# EAGLE design iwing-mrf_shield9 - Plus front-end (EAGLE 6.5.0)
IWING-MRF Shield The Extension Board containing peripherals for IWING-MRF v1.4. Please put IWING-MRF on TOP of Shield.
AUTHOR: Pasakorn Tiwatthanont; REV: 1
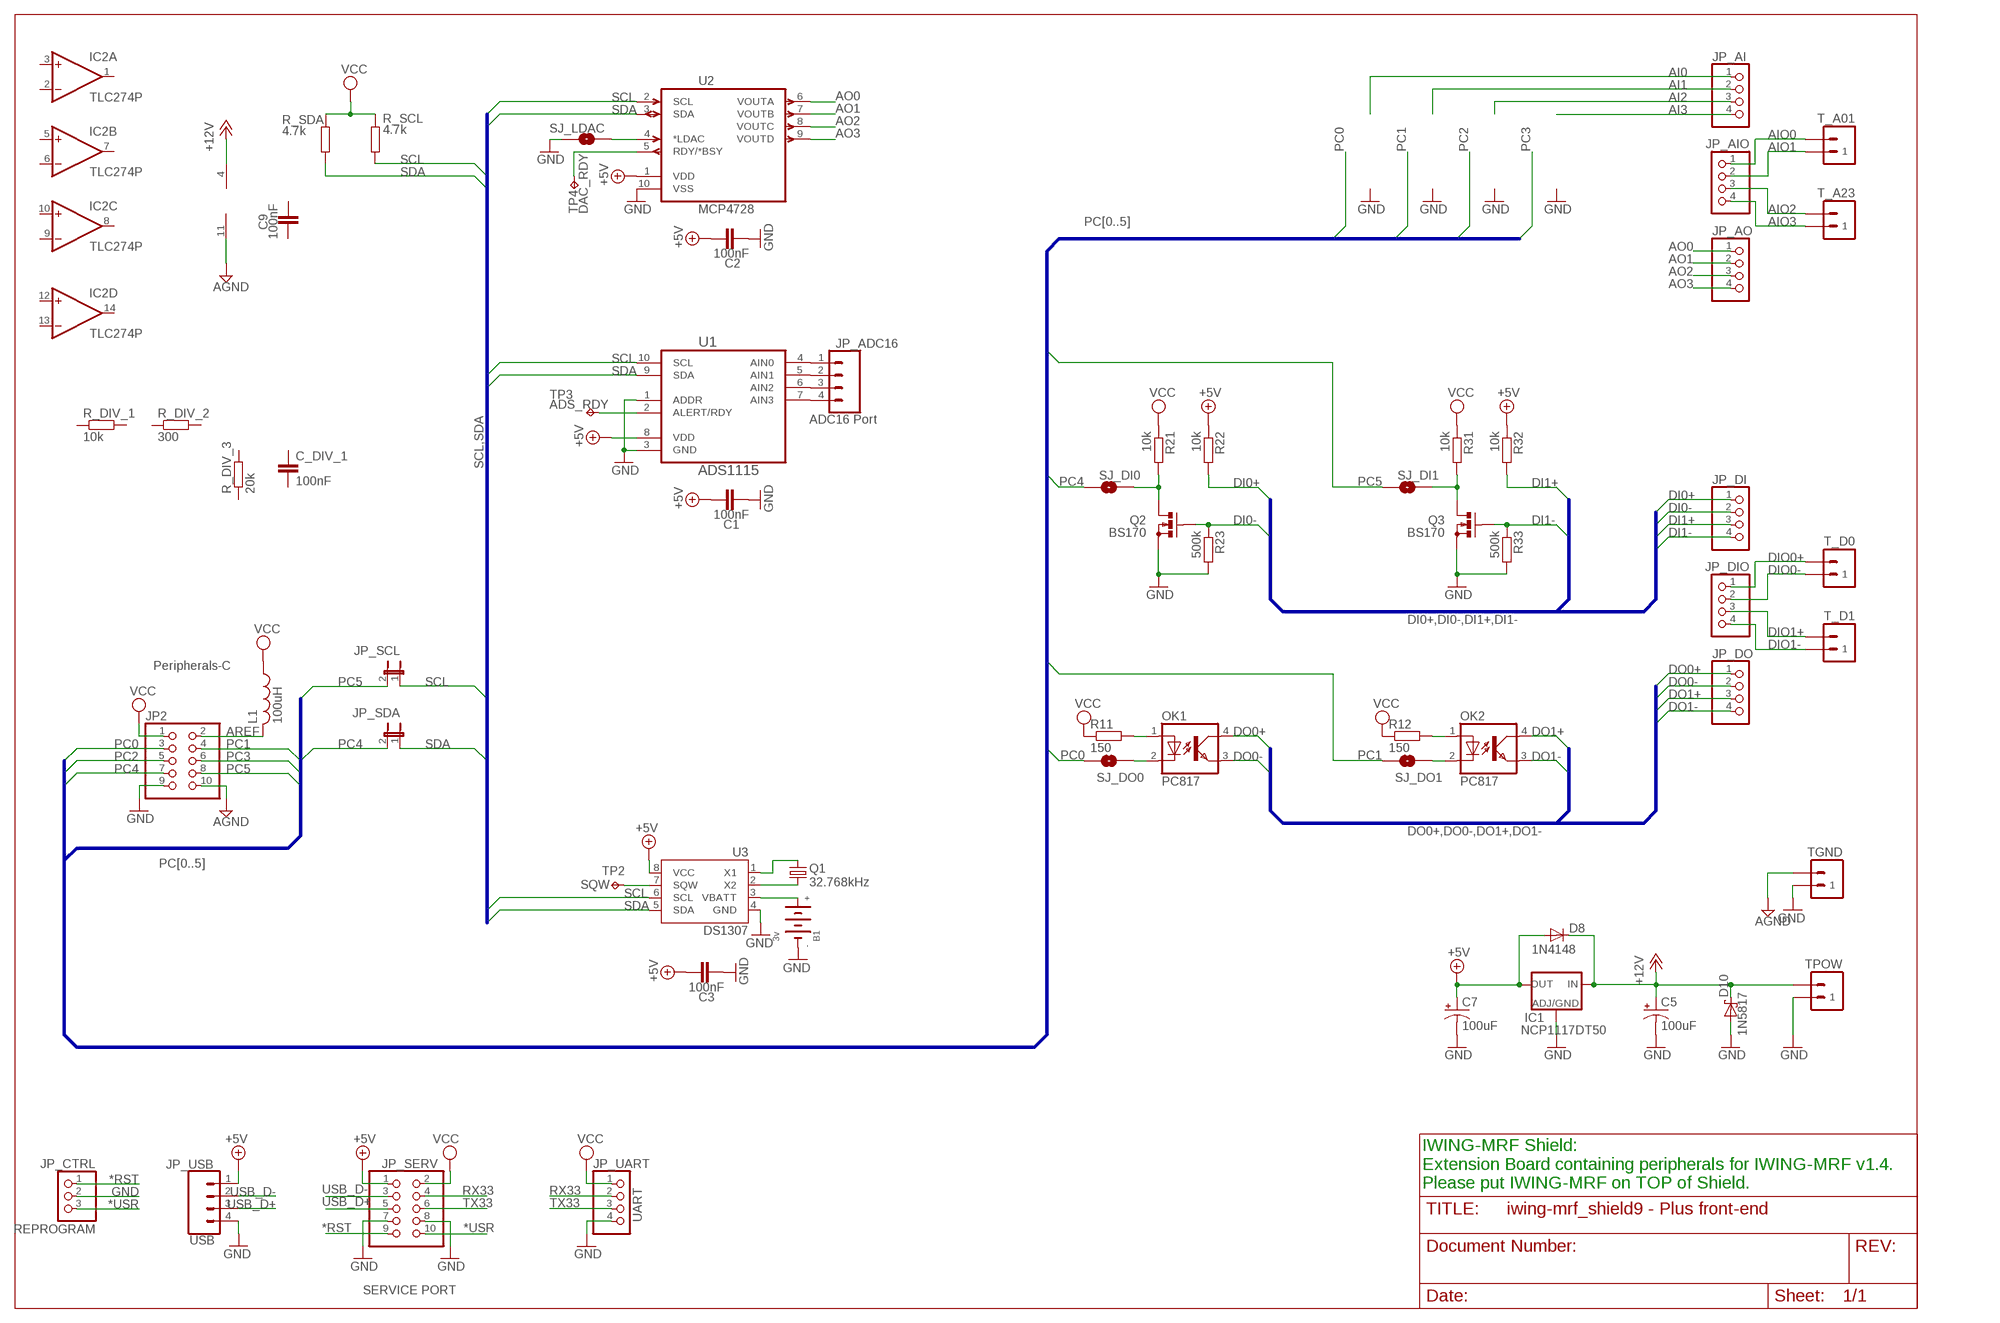
[diagram p0: schematic, sheet 1]

## Parts
B1  3v  BATTERYCR2032  [CR2032]
C1  100nF  RCL_C-EU050-025X075  [RCL_C050-025X075]
C2  100nF  RCL_C-EU050-025X075  [RCL_C050-025X075]
C3  100nF  RCL_C-EU050-025X075  [RCL_C050-025X075]
C5  100uF  RCL_CPOL-USE2.5-7  [RCL_E2,5-7]
C7  100uF  RCL_CPOL-USE2.5-7  [RCL_E2,5-7]
C9  100nF  RCL_C-EU050-025X075  [RCL_C050-025X075]
C_DIV_1  100nF  RCL_C-EU050-025X075  [RCL_C050-025X075]
D8  1N4148  1N4148-V  [DO35-100V]
D10  1N5817  1N5819-V  [DO41-150V]
IC1  NCP1117DT50  [DPACK]
IC2  TLC274P  [DIL14]
JP2  HEADER-2X5  [2X05]
JP_ADC16  ADC16 Port  M04PTH  [1X04]
JP_AI  HEADER-1X4ROUND  [1X04_ROUND]
JP_AIO  HEADER-1X4ROUND  [1X04_ROUND]
JP_AO  HEADER-1X4ROUND  [1X04_ROUND]
JP_CTRL  REPROGRAM  PINHD-1X3  [1X03]
JP_DI  HEADER-1X4ROUND  [1X04_ROUND]
JP_DIO  HEADER-1X4ROUND  [1X04_ROUND]
JP_DO  HEADER-1X4ROUND  [1X04_ROUND]
JP_SCL  JUMPER-2SMD-NO  [SJ_2S-NO]
JP_SDA  JUMPER-2SMD-NO  [SJ_2S-NO]
JP_SERV  SERVICE PORT  HEADER-2X5  [2X05]
JP_UART  HEADER-1X4ROUND  [1X04_ROUND]
JP_USB  USB  M04PTH  [1X04]
L1  100uH  L-US0204/5  [0204/5]
OK1  PC817  [DIL04]
OK2  PC817  [DIL04]
Q1  32.768kHz  CRYSTAL_CRYSTALTC26H  [CRYSTAL_TC26H]
Q2  BS170  [TO92-]
Q3  BS170  [TO92-]
R11  150  R-EU_0204/5  [0204/5]
R12  150  R-EU_0204/5  [0204/5]
R21  10k  R-EU_0204/5  [0204/5]
R22  10k  R-EU_0204/5  [0204/5]
R23  500k  R-EU_0204/5  [0204/5]
R31  10k  R-EU_0204/5  [0204/5]
R32  10k  R-EU_0204/5  [0204/5]
R33  500k  R-EU_0204/5  [0204/5]
R_DIV_1  10k  R-EU_0204/5  [0204/5]
R_DIV_2  300  R-EU_0204/5  [0204/5]
R_DIV_3  20k  R-EU_0204/5  [0204/5]
R_SCL  4.7k  R-EU_0204/5  [0204/5]
R_SDA  4.7k  R-EU_0204/5  [0204/5]
SJ_DI0  SOLDERJUMPERNO  [SJ_2S-NO]
SJ_DI1  SOLDERJUMPERNO  [SJ_2S-NO]
SJ_DO0  SOLDERJUMPERNO  [SJ_2S-NO]
SJ_DO1  SOLDERJUMPERNO  [SJ_2S-NO]
SJ_LDAC  SOLDERJUMPERNO  [SJ_2S-NO]
T_A01  ST02-5MM  [EK500V-02P]
T_A23  ST02-5MM  [EK500V-02P]
T_D0  ST02-5MM  [EK500V-02P]
T_D1  ST02-5MM  [EK500V-02P]
TGND  ST02-5MM  [EK500V-02P]
TP2  TPPAD1-13  [P1-13]
TP3  TPB1,27  [B1,27]
TP4  TPPAD1-13  [P1-13]
TPOW  ST02-5MM  [EK500V-02P]
U1  ADS1115  ADS1115IDGST  [MSOP-10]
U2  MCP4728  MCP4728-E/UN  [MSOP-10]
U3  DS1307  DS1307D08  [DIL08]

## Nets
*RST: JP_CTRL.1 JP_SERV.9
*USR: JP_CTRL.3 JP_SERV.10
+5V: C1.1 C2.1 C3.1 C7.+ D8.A IC1.4(OUT) JP_SERV.1 JP_USB.1 R22.1 R32.1 U1.8(VDD) U2.1(VDD) U3.8(VCC)
+12V: C5.+ D8.C D10.C IC1.3(IN) IC2.4(P:V+) TPOW.P$2
AGND: IC2.11(P:V-) JP2.10 TGND.P$2
AI0: JP_AI.1
AI1: JP_AI.2
AI2: JP_AI.3
AI3: JP_AI.4
AIO0: JP_AIO.1 T_A01.P$2
AIO1: JP_AIO.2 T_A01.P$1
AIO2: JP_AIO.3 T_A23.P$2
AIO3: JP_AIO.4 T_A23.P$1
AO0: JP_AO.1 U2.6(VOUTA)
AO1: JP_AO.2 U2.7(VOUTB)
AO2: JP_AO.3 U2.8(VOUTC)
AO3: JP_AO.4 U2.9(VOUTD)
AREF: JP2.2 L1.2
DI0+: JP_DI.1 R22.2
DI0-: JP_DI.2 Q2.2(G) R23.1
DI1+: JP_DI.3 R32.2
DI1-: JP_DI.4 Q3.2(G) R33.1
DIO0+: JP_DIO.1 T_D0.P$2
DIO0-: JP_DIO.2 T_D0.P$1
DIO1+: JP_DIO.3 T_D1.P$2
DIO1-: JP_DIO.4 T_D1.P$1
DO0+: JP_DO.1 OK1.4(COL)
DO0-: JP_DO.2 OK1.3(EMIT)
DO1+: JP_DO.3 OK2.4(COL)
DO1-: JP_DO.4 OK2.3(EMIT)
GND [power]: B1.- C1.2 C2.2 C3.2 C5.- C7.- D10.A IC1.1(ADJ) JP2.9 JP_CTRL.2 JP_SERV.7 JP_SERV.8 JP_UART.4 JP_USB.4 Q2.3(S) Q3.3(S) R23.2 R33.2 SJ_LDAC.1 TGND.P$1 TPOW.P$1 U1.1(ADDR) U1.3(GND) U2.10(VSS) U3.4(GND)
N$2: TP2.TP U3.7(SQW)
N$3: Q1.1 U3.2(X2)
N$4: TP4.TP U2.5(RDY/*BSY)
N$5: OK2.2(C) SJ_DO1.2
N$6: OK1.2(C) SJ_DO0.2
N$7: SJ_LDAC.2 U2.4(*LDAC)
N$8: TP3.TP U1.2(ALERT/RDY)
N$9: Q2.1(D) R21.2 SJ_DI0.1
N$10: Q3.1(D) R31.2 SJ_DI1.1
N$11: OK1.1(A) R11.2
N$13: JP_ADC16.1 U1.4(AIN0)
N$14: JP_ADC16.2 U1.5(AIN1)
N$15: JP_ADC16.3 U1.6(AIN2)
N$16: JP_ADC16.4 U1.7(AIN3)
N$20: OK2.1(A) R12.2
N$21: Q1.2 U3.1(X1)
N$23: B1.+ U3.3(VBATT)
PC0: JP2.3 SJ_DO0.1
PC1: JP2.4 SJ_DO1.1
PC2: JP2.5
PC3: JP2.6
PC4: JP2.7 JP_SDA.2 SJ_DI0.2
PC5: JP2.8 JP_SCL.2 SJ_DI1.2
RX33: JP_UART.2
SCL: JP_SCL.1 R_SCL.2 U1.10(SCL) U2.2(SCL) U3.6(SCL)
SDA: JP_SDA.1 R_SDA.2 U1.9(SDA) U2.3(SDA) U3.5(SDA)
TX33: JP_UART.3
USB_D+: JP_SERV.5 JP_USB.3
USB_D-: JP_SERV.3 JP_USB.2
VCC [power]: JP2.1 JP_SERV.2 JP_UART.1 L1.1 R11.1 R12.1 R21.1 R31.1 R_SCL.1 R_SDA.1
Unconnected: C9.1 C9.2 C_DIV_1.1 C_DIV_1.2 IC2.1(A:OUT) IC2.2(A:-IN) IC2.3(A:+IN) IC2.5(B:+IN) IC2.6(B:-IN) IC2.7(B:OUT) IC2.8(C:OUT) IC2.9(C:-IN) IC2.10(C:+IN) IC2.12(D:+IN) IC2.13(D:-IN) IC2.14(D:OUT) JP_SERV.4 JP_SERV.6 R_DIV_1.1 R_DIV_1.2 R_DIV_2.1 R_DIV_2.2 R_DIV_3.1 R_DIV_3.2

## Buses
SCL,SDA
DO0+,DO0-,DO1+,DO1-
DI0+,DI0-,DI1+,DI1-
PC[0..5]

## Notes on the sheet
- Peripherals-C
- UART
- IWING-MRF Shield:
  Extension Board containing peripherals for IWING-MRF v1.4.
  Please put IWING-MRF on TOP of Shield.

## Library data of the parts
B1 = microbuilder:BATTERY
C1-C3 C9 C_DIV_1 = ipas:RCL_C-EU: CAPACITOR, European symbol
C5 C7 = SDI12IB_v0.5:RCL_CPOL-US: POLARIZED CAPACITOR, American symbol
D8 = ipas:1N4148: DIODE high speed (Philips)
D10 = ipas:1N5819: DIODE 1N5817 THRU 1N5819 1.0 AMP. Schottky Barrier Rectifiers Features Low forward voltage drop High current capability High reliability High surge current capability
IC1 = ipas:NCP1117?*: Low drop-out positive fixed and adjustable voltage regulator
IC2 = linear:TLC274: OP AMP
JP2 JP_SERV = microbuilder:HEADER-2X5: PIN HEADER
JP_ADC16 JP_USB = ipas:M04: Header 4 Standard 4-pin 0.1" header. Use with straight break away headers (SKU : PRT-00116), right angle break away headers (PRT-00553), swiss pins (PRT-00743), machine pins (PRT-00117), and female headers (PRT-00115). Molex polarized connector foot print use with SKU : PRT-08231 with associated crimp pins and housings. 1MM SMD Version SKU: PRT-10208
JP_AI JP_AIO JP_AO JP_DI JP_DIO JP_DO JP_UART = microbuilder:HEADER-1X4: PIN HEADER
JP_CTRL = pinhead:PINHD-1X3: PIN HEADER
JP_SCL JP_SDA = SparkFun-Passives:JUMPER-2: Jumper Basic 0.1" spaced jumper. Use with breakaway headers.
L1 = ipas:L-US: INDUCTOR, American symbol
OK1 OK2 = ipas:PC817: SHARP OPTO COUPLER; MPN: PC817X4J000F; OC_FARNELL: 9707727; OC_NEWARK: 97K7059
Q1 = iwing-mrf:CRYSTAL_CRYSTAL: CRYSTAL
Q2 Q3 = ipas:BS170: N-CHANNEL MOS FET Small Signal MOSFET 500 mA, 60 Volts
R11 R12 R21-R23 R31-R33 R_DIV_1-R_DIV_3 R_SCL R_SDA = rcl:R-EU_: RESISTOR, European symbol
SJ_DI0 SJ_DI1 SJ_DO0 SJ_DO1 SJ_LDAC = SparkFun-Passives:SOLDERJUMPER: Solder Jumper Standard SMD solder jumper. Used to automate production. Two varients : Normally Open and Normally Closed are the same, but have different paste layers. NC will have a large amount of paste and should jumper during reflow.
T_A01 T_A23 T_D0 T_D1 TGND TPOW = ipas:ST02: Dinkle® Screw Terminal Block - 2 Way -5MM: EK500V series. Rated at 20A, 300VAC. Cable size: 2mm² Supplier: Altronics P2034A Source: http://www.dinkle.com/upfiles/proter21253708953.pdf -5.08MM: The back half of a EK500V4R-04P. Rated at 20A, 300VAC. Cable size: 2mm² Supplier: Altronics P2024 (half of) Source: http://www.dinkle.com/upfiles/proter21253708833.pdf -3.5MM: ED350V series. Rated at 10A, 300VAC. Cable size: 1.4mm² Supplier: Altronics P2028 Source: http://www.dinkle.com/upfiles/proter21253714491.pdf
TP2 = testpad:TP: Test pad; TP_SIGNAL_NAME: SQW
TP3 = testpad:TP: Test pad; TP_SIGNAL_NAME: ADS_RDY
TP4 = testpad:TP: Test pad; TP_SIGNAL_NAME: DAC_RDY
U1 = ipas:ADS1115IDGST: Analog-to-Digital Converter with Internal Reference
U2 = ipas:MCP4728-E/UN: IC, DAC, 12BIT, QUAD
U3 = ipas:DS1307: I2C real-time clock with battery backup.

## Net classes
0 default: width 0.254 mm
1 power: width 0.406 mm

## Board
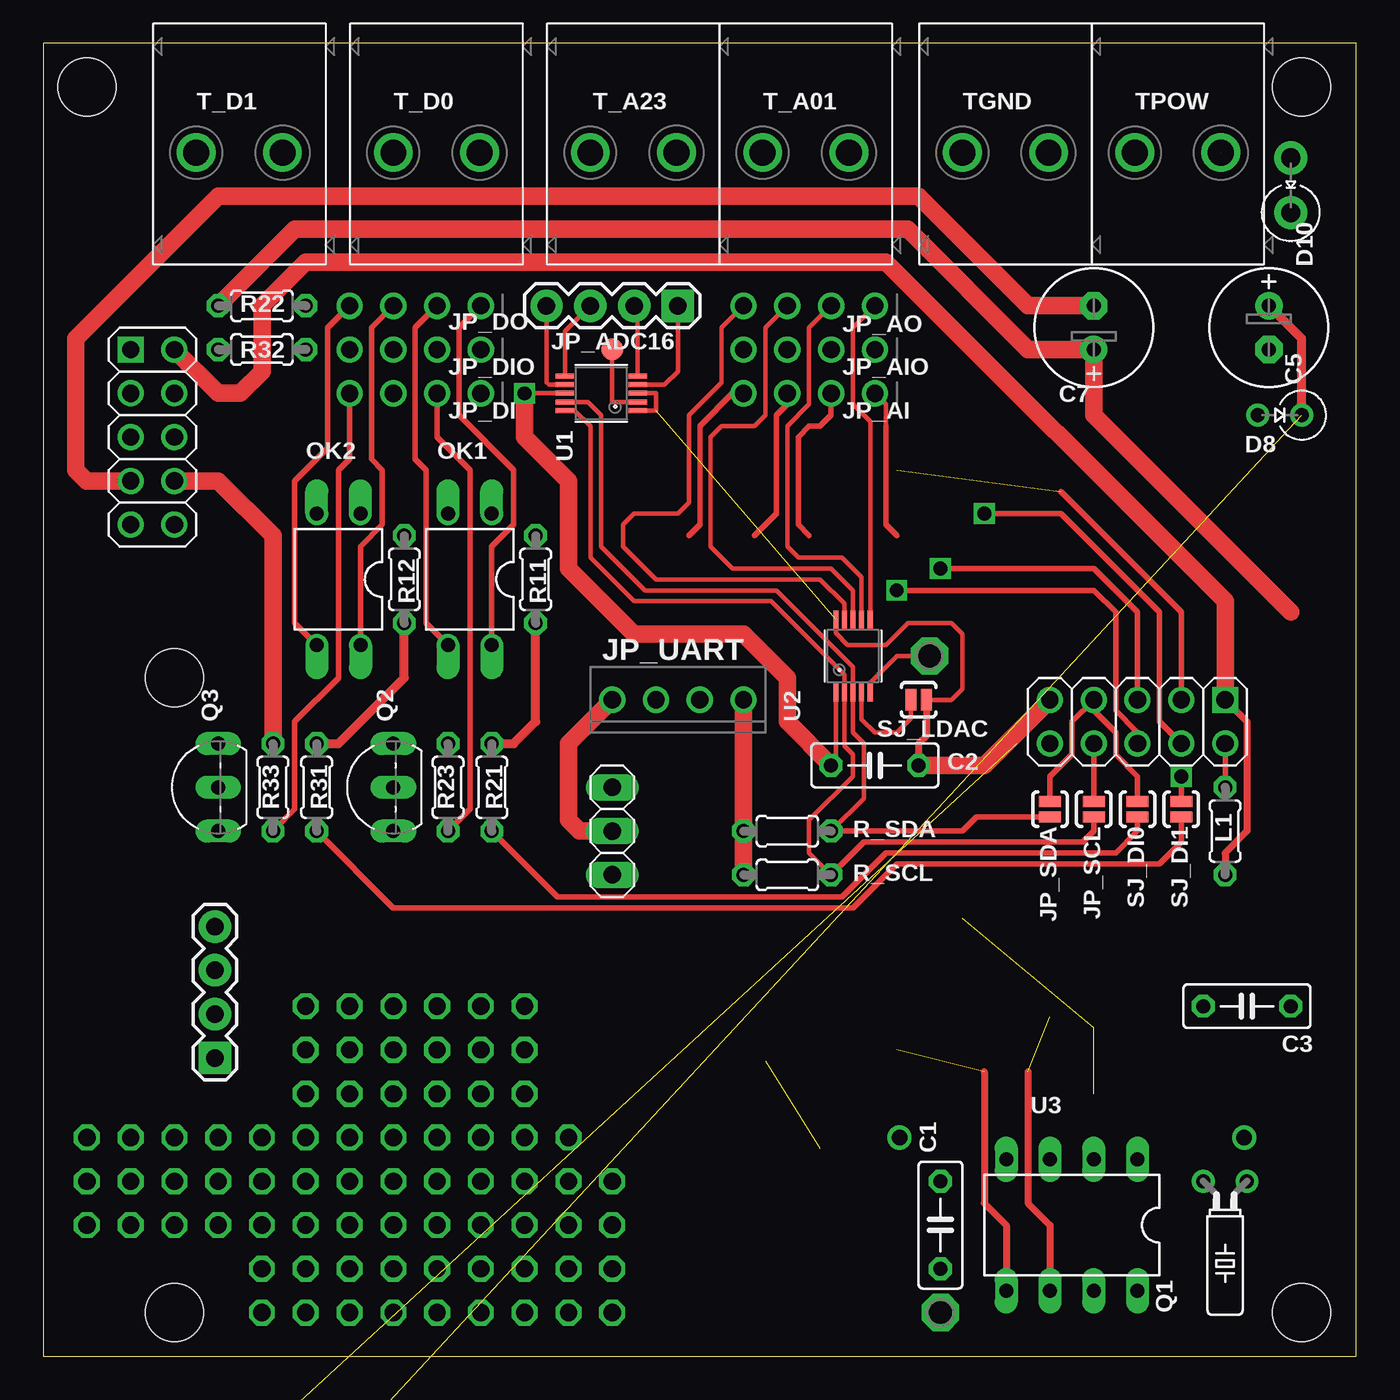
[diagram p1: board, top side]
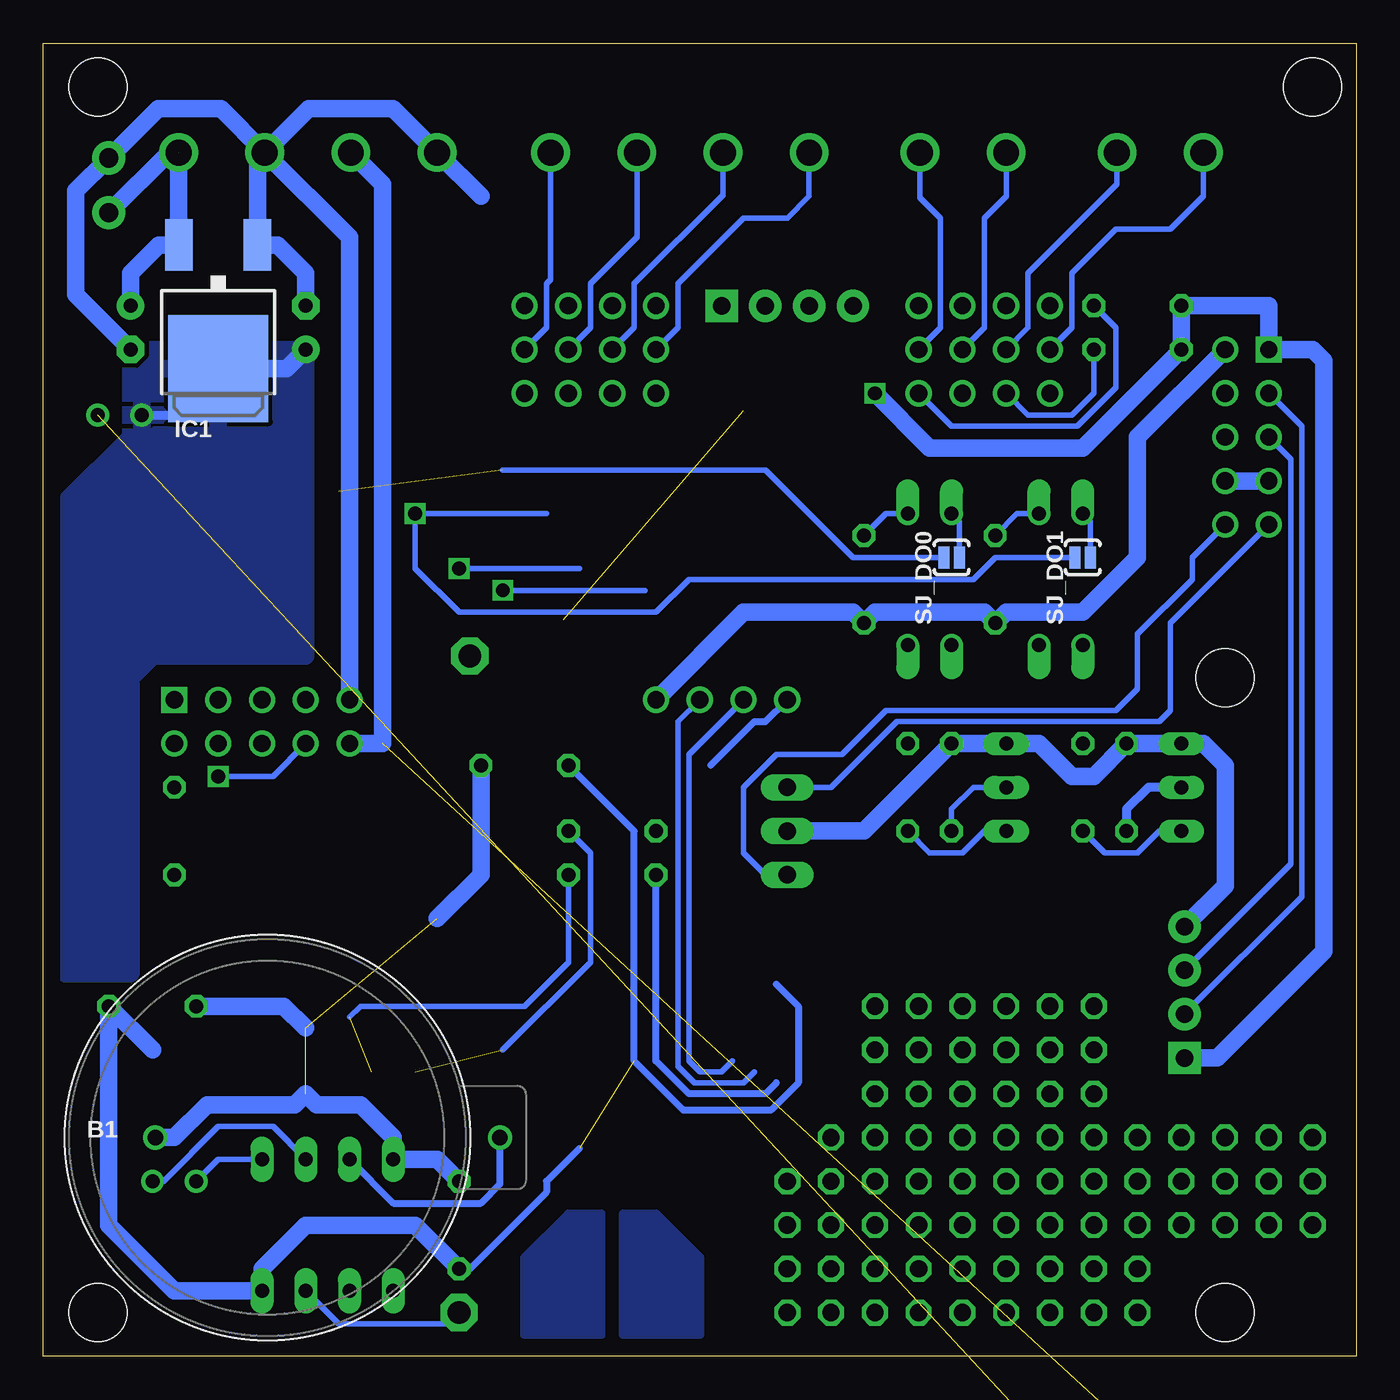
[diagram p2: board, bottom side, seen from below]

Size 76.2 x 76.2 mm. Coordinates in mm from the lower left corner, seen from the top.
Outline: 0,0 76.2,0 76.2,76.2 0,76.2 0,0
Copper layers (1*16): Top 0.035mm / dielectric 1.5mm / Bottom 0.035mm
Design rules "default *": minimum track width 10mil, minimum drill 24mil, track to track 10mil, track to pad 10mil, pad to pad 10mil, via to via 10mil, smd to smd 10mil, copper to edge 40mil, drill to drill 10mil, minimum pad ring 10mil, minimum via ring 8mil, stop-mask expansion 4mil, vias tented up to drill 0mil, thermal gap 10mil
Holes 3.35 mm at 7.62,39.37 7.62,2.54 2.54,73.66 73.03,73.66 73.03,2.54

### Footprints (pad centres in the part's own frame; a part is rotated, then mirrored left to right if it is on the bottom)
CR2032 = drill 0.9: + 10,0; - -10,0
RCL_C050-025X075 = drill 0.813 octagon: 1 -2.54,0; 2 2.54,0
RCL_E2,5-7 = drill 0.813 pad 1.6: + -1.27,0 | drill 0.813 pad 1.6 octagon: - 1.27,0
DO35-100V = drill 0.813: A 1.27,0; C -1.27,0
DO41-150V = drill 1.118 pad 1.93: A 1.587,0; C -1.587,0
DPACK = smd 1.6 x 3: 1 -2.28,-4.8; 3 2.28,-4.8 | smd 5.8 x 6.2: 4 0,2.38
DIL14 = drill 0.813 long: 1 -7.62,-3.81; 2 -5.08,-3.81; 3 -2.54,-3.81; 4 0,-3.81; 5 2.54,-3.81; 6 5.08,-3.81; 7 7.62,-3.81; 8 7.62,3.81; 9 5.08,3.81; 10 2.54,3.81; 11 0,3.81; 12 -2.54,3.81; 13 -5.08,3.81; 14 -7.62,3.81
2X05 = drill 1 square: 1 -5.08,-1.27 | drill 1: 2 -5.08,1.27; 3 -2.54,-1.27; 4 -2.54,1.27; 5 0,-1.27; 6 0,1.27; 7 2.54,-1.27; 8 2.54,1.27; 9 5.08,-1.27; 10 5.08,1.27
1X04 = drill 1.016 pad 1.88 square: 1 0,0 | drill 1.016 pad 1.88: 2 2.54,0; 3 5.08,0; 4 7.62,0
1X04_ROUND = drill 1 pad 1.524: 1 -3.81,0; 2 -1.27,0; 3 1.27,0; 4 3.81,0
1X03 = drill 1.016 long: 1 -2.54,0; 2 0,0; 3 2.54,0
SJ_2S-NO = smd 0.635 x 1.27: 1 -0.45,0; 2 0.45,0
0204/5 = drill 0.813 octagon: 1 -2.54,0; 2 2.54,0
DIL04 = drill 0.813 offset: 1 -1.27,-3.81; 2 1.27,-3.81; 3 1.27,3.81; 4 -1.27,3.81
CRYSTAL_TC26H = drill 0.813: 1 -1.27,0; 2 1.27,0
TO92- = drill 0.813 long: 1 -2.54,0; 2 0,0; 3 2.54,0
EK500V-02P = drill 1.5: P$1 0,0; P$2 5,0
P1-13 = drill 1.321 pad 2.159 octagon: TP 0,0
B1,27 = smd 1.27 x 1.27: TP 0,0
MSOP-10 = smd 0.292 x 1.067: 1 -1,-2.11; 2 -0.5,-2.11; 3 0,-2.11; 4 0.5,-2.11; 5 1,-2.11; 6 1,2.11; 7 0.5,2.11; 8 0,2.11; 9 -0.5,2.11; 10 -1,2.11
DIL08 = drill 0.813 long: 1 -3.81,-3.81; 2 -1.27,-3.81; 3 1.27,-3.81; 4 3.81,-3.81; 5 3.81,3.81; 6 1.27,3.81; 7 -1.27,3.81; 8 -3.81,3.81

### Placement (x,y rotation side)
B1  59.69,12.7 0 bottom
C1  52.07,7.62 90 top
C2  48.26,34.29 0 top
C3  69.85,20.32 180 top
C5  71.12,59.69 270 top
C7  60.96,59.69 90 top
C9  -5.08,-58.42 0 top  (outside the outline)
C_DIV_1  -5.08,-50.8 0 top  (outside the outline)
D8  71.75,54.61 180 top
D10  72.39,67.94 90 top
IC1  66.04,59.69 180 bottom
IC2  2.54,-17.78 0 top  (outside the outline)
JP2  63.5,36.83 180 top
JP_ADC16  36.83,60.96 180 top
JP_AI  44.45,55.88 180 top
JP_AIO  44.45,58.42 180 top
JP_AO  44.45,60.96 180 top
JP_CTRL  33.02,30.48 270 top
JP_DI  21.59,55.88 180 top
JP_DIO  21.59,58.42 180 top
JP_DO  21.59,60.96 180 top
JP_SCL  60.96,31.75 90 top
JP_SDA  58.42,31.75 90 top
JP_SERV  6.35,53.34 270 top
JP_UART  36.83,38.1 180 top
JP_USB  9.97,17.32 90 top
L1  68.58,30.48 90 top
OK1  24.77,45.09 180 top
OK2  17.14,45.09 180 top
Q1  68.58,10.16 180 top
Q2  20.32,33.02 90 top
Q3  10.16,33.02 90 top
R11  28.57,45.09 90 top
R12  20.95,45.09 90 top
R21  26.04,33.02 270 top
R22  12.7,60.96 0 top
R23  23.5,33.02 90 top
R31  15.88,33.02 270 top
R32  12.7,58.42 0 top
R33  13.34,33.02 90 top
R_DIV_1  -5.08,-27.94 0 top  (outside the outline)
R_DIV_2  -5.08,-35.56 0 top  (outside the outline)
R_DIV_3  -5.08,-43.18 0 top  (outside the outline)
R_SCL  43.18,27.94 0 top
R_SDA  43.18,30.48 0 top
SJ_DI0  63.5,31.75 90 top
SJ_DI1  66.04,31.75 90 top
SJ_DO0  23.5,46.35 0 bottom
SJ_DO1  15.88,46.35 0 bottom
SJ_LDAC  50.8,38.1 180 top
T_A01  41.75,69.85 0 top
T_A23  31.75,69.85 0 top
T_D0  20.32,69.85 0 top
T_D1  8.89,69.85 0 top
TGND  53.34,69.85 0 top
TP2  52.07,2.54 0 top
TP3  33.02,58.42 0 top
TP4  51.44,40.64 0 top
TPOW  63.34,69.85 0 top
U1  32.38,55.88 90 top
U2  46.99,40.64 0 top
U3  59.69,7.62 180 top

### Tracks (layer width: path | path; a pad name or v marks a point on that pad's centre or on a via)
*RST
  Bottom 0.305: JP_SERV.9 10.79,42.55 10.79,37.47 11.43,36.83 26.67,36.83 30.48,33.02 JP_CTRL.1
*USR
  Bottom 0.305: JP_CTRL.3 34.29,27.94 35.56,29.21 35.56,33.02 33.66,34.92 29.84,34.92 27.3,37.47 13.97,37.47 12.7,38.73 12.7,41.91 9.53,45.09 9.53,46.35 JP_SERV.10
+5V  (via drill 0.8)  (1 unrouted)
  Top 0.254: U2.1 45.99,34.56 C2.1 | U1.8 v27.94,55.88
  Top 1.016: R22.1 14.61,65.41 50.16,65.41 57.15,58.42 C7.+ 60.96,54.61 72.39,43.18 | v27.94,55.88 27.94,53.34 30.48,50.8 30.48,45.72 34.29,41.91 40.64,41.91 43.18,39.37 43.18,36.83 C2.1
  Bottom 0.406: 33.66,21.59 32.38,20.32 32.38,15.88 33.97,14.29 39.05,14.29 41.91,17.14 41.91,30.48 C2.1 | 45.09,12.06 46.99,10.16 46.99,9.53 51.44,5.08 C1.1
  Bottom 0.508: D8.A 68.74,54.61 IC1.4
  Bottom 1.016: C7.+ 62.07,57.31 IC1.4 | v27.94,55.88 24.77,52.7 15.88,52.7 R32.1 R22.1 5.08,60.96 JP_SERV.1 2.54,58.42 1.91,57.78 1.91,23.5 8.08,17.32 JP_USB.1 | 69.85,17.78 C3.1 72.39,7.62 68.58,3.81 U3.8 63.5,5.08 60.96,7.62 54.61,7.62 C1.1
  pour Bottom: 60.96,40.64 69.85,40.64 71.12,39.37 71.12,22.23 74.93,22.23 74.93,49.53 71.12,53.34 71.12,58.42 60.96,58.42
+12V  (2 unrouted)
  Top 0.508: D8.C 73.03,59.05 C5.+
  Bottom 1.016: 68.32,69.83 IC1.3 69.5,64.49 71.12,62.87 C5.+ | D10.C 68.9,69.85 TPOW.P$2
AC+
  pour Bottom (no thermals): 43.81,8.26 45.72,8.26 48.26,5.71 48.26,1.27 43.81,1.27
AC-
  pour Bottom (no thermals): 38.1,5.71 40.64,8.26 42.55,8.26 42.55,1.27 38.1,1.27
AGND  (1 unrouted)
  Bottom 1.016: JP2.10 56.52,35.56 56.52,68.03 TGND.P$2
AI0
  Top 0.254: 48.9,53.98 48.9,55.24 JP_AI.1
  Top 0.305: 49.53,47.62 48.9,48.26 48.9,53.98
AI1
  Top 0.305: 44.45,47.62 43.81,48.26 43.81,53.34 44.45,53.98 45.09,53.98 45.72,54.61 JP_AI.2
AI2
  Top 0.305: 41.27,47.62 42.55,48.9 42.55,54.61 43.18,55.24 JP_AI.3
AI3
  Top 0.305: 37.47,47.62 38.1,48.26 38.1,53.98 40.01,55.88 JP_AI.4
AIO0
  Bottom 0.305: JP_AIO.1 46.99,59.69 46.99,62.23 46.75,62.47 T_A01.P$2
AIO1
  Bottom 0.305: JP_AIO.2 44.45,59.69 44.45,62.23 41.75,64.93 T_A01.P$1
AIO2
  Bottom 0.305: JP_AIO.3 41.91,59.69 41.91,62.23 36.75,67.39 T_A23.P$2
AIO3
  Bottom 0.305: JP_AIO.4 39.37,59.69 39.37,62.23 35.56,66.04 33.02,66.04 31.75,67.31 T_A23.P$1
AO0
  Top 0.254: U2.6 47.99,54.24 46.99,55.24 46.99,59.69 JP_AO.1
AO1
  Top 0.254: U2.7 47.49,45.22 46.35,46.35 43.81,46.35 43.18,46.99 43.18,53.98 44.45,55.24 44.45,59.69 JP_AO.2
AO2
  Top 0.254: U2.8 46.99,44.45 45.72,45.72 40.01,45.72 38.73,46.99 38.73,53.34 39.37,53.98 41.27,53.98 41.91,54.61 41.91,59.69 JP_AO.3
AO3
  Top 0.254: U2.9 46.49,43.68 45.09,45.09 35.56,45.09 33.66,46.99 33.66,48.26 34.29,48.9 36.83,48.9 37.47,49.53 37.47,54.61 39.37,56.52 39.37,59.69 JP_AO.4
AREF
  Top 0.305: L1.2 JP2.2
DI0+
  Bottom 0.305: JP_DI.1 23.5,53.98 16.19,53.98 13.97,56.2 13.97,59.69 R22.2
DI0-
  Top 0.305: JP_DI.2 22.86,53.34 24.77,51.44 24.77,31.75 R23.1
  Bottom 0.305: Q2.2 22.23,33.02 23.5,31.75 R23.1
DI1+
  Bottom 0.305: JP_DI.3 19.05,54.61 16.51,54.61 15.24,55.88 R32.2
DI1-
  Top 0.305: JP_DI.4 17.78,52.07 17.14,51.44 17.14,39.37 14.61,36.83 14.61,31.75 R33.1
  Bottom 0.508: Q3.2 12.06,33.02 13.34,31.75 R33.1
DIO0+
  Bottom 0.305: JP_DIO.1 24.13,59.69 24.13,66.04 25.32,67.23 T_D0.P$2
DIO0-
  Bottom 0.305: JP_DIO.2 21.59,59.69 21.59,66.04 20.32,67.31 T_D0.P$1
DIO1+
  Bottom 0.305: JP_DIO.3 19.05,59.69 19.05,62.87 13.89,68.03 T_D1.P$2
DIO1-
  Bottom 0.305: JP_DIO.4 16.51,59.69 16.51,62.87 13.97,65.41 10.79,65.41 8.89,67.31 T_D1.P$1
DO0+
  Top 0.305: JP_DO.1 24.13,59.69 24.13,54.61 27.3,51.44 27.3,48.26 26.04,46.99 OK1.4
DO0-
  Top 0.305: JP_DO.2 21.59,59.69 21.59,52.07 22.23,51.44 22.23,42.55 OK1.3
DO1+
  Top 0.305: JP_DO.3 19.05,59.69 19.05,52.07 19.68,51.44 19.68,48.26 18.41,46.99 OK2.4
DO1-
  Top 0.305: JP_DO.4 16.51,59.69 16.51,52.7 14.61,50.8 14.61,42.55 OK2.3
GND  (3 unrouted)
  Top 0.254: U2.10 45.99,41.96 46.67,41.27 48.9,41.27 50.16,42.55 52.7,42.55 53.34,41.91 53.34,38.73 52.7,38.1 SJ_LDAC.1 | U1.3 35.56,55.88 35.56,54.88 U1.1
  Top 0.406: SJ_LDAC.1 51.25,36.01 50.8,35.56 C2.2
  Top 1.016: C2.2 54.61,34.29 JP2.9 | JP_CTRL.2 31.11,30.48 30.48,31.11 30.48,35.56 JP_UART.4 | JP_SERV.8 10.16,50.8 13.34,47.62 R33.2 | JP_SERV.7 2.54,50.8 1.91,51.44 1.91,59.05 10.16,67.31 50.8,67.31 57.15,60.96 C7.-
  Bottom 0.406: 37.47,34.29 34.92,36.83 34.29,36.83 JP_UART.4
  Bottom 1.016: TPOW.P$1 63.76,69.43 IC1.1 62.59,64.49 60.96,62.87 C7.- | TPOW.P$1 60.8,72.39 55.88,72.39 TGND.P$1 50.8,67.31 | TPOW.P$1 65.88,72.39 69.53,72.39 D10.A 74.3,67.63 74.3,61.59 C5.- | JP2.9 58.42,64.93 TPOW.P$1 | JP_CTRL.2 28.57,30.48 R23.2 Q2.3 18.41,35.56 16.51,33.66 15.24,33.66 R33.2 Q3.3 8.89,35.56 7.62,34.29 7.62,27.29 JP_USB.4 | JP_SERV.7 JP_SERV.8 | 53.34,25.4 50.8,27.94 C2.2 | 60.96,19.05 62.23,20.32 C3.2 | B1.- 68.58,12.7 66.67,14.61 61.59,14.61 60.96,15.24 60.33,14.61 57.78,14.61 55.88,12.7 U3.4 53.34,11.43 C1.2
N$2
  Bottom 0.305: U3.7 59.05,1.91 52.7,1.91 TP2.TP
N$3
  Bottom 0.305: Q1.1 69.22,10.16 66.04,13.34 62.87,13.34 U3.2
N$4
  Top 0.254: U2.5 47.99,39.1 49.53,40.64 TP4.TP
N$5
  Bottom 0.305: OK2.2 15.43,48.45 SJ_DO1.2
N$6
  Bottom 0.305: OK1.2 23.05,48.45 SJ_DO0.2
N$7
  Top 0.254: U2.4 47.49,36.97 48.26,36.2 49.53,36.2 50.35,37.02 SJ_LDAC.2
N$8
  Top 0.254: U1.2 33.02,55.38 TP3.TP
N$9
  Top 0.305: SJ_DI0.1 63.5,30.48 62.23,29.21 48.9,29.21 46.35,26.67 29.84,26.67 R21.2
  Bottom 0.305: R21.2 24.77,29.21 22.86,29.21 21.59,30.48 Q2.1
N$10
  Top 0.305: SJ_DI1.1 66.04,29.84 64.77,28.57 49.53,28.57 46.99,26.04 20.32,26.04 R31.2
  Bottom 0.305: R31.2 14.61,29.21 12.7,29.21 11.43,30.48 Q3.1
N$11
  Bottom 0.305: R11.2 27.3,48.9 OK1.1
N$12  (via drill 1)
  other vias: 5.08,12.7
N$13
  Top 0.254: U1.4 36.06,56.38 36.83,57.15 JP_ADC16.1
N$14
  Top 0.254: U1.5 34.49,60.76 JP_ADC16.2
N$15
  Top 0.254: U1.6 30.28,59.49 JP_ADC16.3
N$16
  Top 0.254: U1.7 29.34,56.38 29.21,56.52 JP_ADC16.4
N$17  (via drill 1)
  other vias: 5.08,10.16
N$18  (via drill 1)
  other vias: 5.08,7.62
N$19  (via drill 1)
  other vias: 7.62,7.62
N$20
  Bottom 0.305: R12.2 19.68,48.9 OK2.1
N$21
  Bottom 0.305: U3.1 66.04,11.43 Q1.2
N$22  (via drill 1)
  other vias: 7.62,10.16
N$23
  Bottom 0.406: U3.3 55.88,8.89 50.8,8.89 49.69,10 B1.+
N$24  (via drill 1)
  other vias: 7.62,12.7
N$25  (via drill 1)
  other vias: 10.16,12.7
N$27  (via drill 1)
  other vias: 10.16,10.16
N$28  (via drill 1)
  other vias: 10.16,7.62
N$29  (via drill 1)
  other vias: 12.7,7.62
N$30  (via drill 1)
  other vias: 12.7,5.08
N$31  (via drill 1)
  other vias: 12.7,2.54
N$32  (via drill 1)
  other vias: 15.24,2.54
N$33  (via drill 1)
  other vias: 15.24,5.08
N$34  (via drill 1)
  other vias: 15.24,7.62
N$35  (via drill 1)
  other vias: 12.7,10.16
N$36  (via drill 1)
  other vias: 12.7,12.7
N$37  (via drill 1)
  other vias: 15.24,12.7
N$38  (via drill 1)
  other vias: 15.24,10.16
N$39  (via drill 1)
  other vias: 17.78,12.7
N$40  (via drill 1)
  other vias: 17.78,10.16
N$41  (via drill 1)
  other vias: 17.78,7.62
N$42  (via drill 1)
  other vias: 17.78,5.08
N$43  (via drill 1)
  other vias: 17.78,2.54
N$44  (via drill 1)
  other vias: 20.32,12.7
N$45  (via drill 1)
  other vias: 20.32,10.16
N$46  (via drill 1)
  other vias: 20.32,7.62
N$47  (via drill 1)
  other vias: 20.32,5.08
N$48  (via drill 1)
  other vias: 20.32,2.54
N$49  (via drill 1)
  other vias: 22.86,12.7
N$50  (via drill 1)
  other vias: 22.86,10.16
N$51  (via drill 1)
  other vias: 22.86,7.62
N$52  (via drill 1)
  other vias: 22.86,5.08
N$53  (via drill 1)
  other vias: 22.86,2.54
N$54  (via drill 1)
  other vias: 25.4,2.54
N$55  (via drill 1)
  other vias: 25.4,5.08
N$56  (via drill 1)
  other vias: 25.4,7.62
N$57  (via drill 1)
  other vias: 25.4,10.16
N$58  (via drill 1)
  other vias: 25.4,12.7
N$59  (via drill 1)
  other vias: 27.94,12.7
N$60  (via drill 1)
  other vias: 27.94,10.16
N$61  (via drill 1)
  other vias: 27.94,7.62
N$62  (via drill 1)
  other vias: 27.94,5.08
N$63  (via drill 1)
  other vias: 27.94,2.54
N$64  (via drill 1)
  other vias: 30.48,2.54
N$65  (via drill 1)
  other vias: 30.48,5.08
N$66  (via drill 1)
  other vias: 30.48,7.62
N$67  (via drill 1)
  other vias: 30.48,10.16
N$68  (via drill 1)
  other vias: 30.48,12.7
N$69  (via drill 1)
  other vias: 33.02,10.16
N$70  (via drill 1)
  other vias: 33.02,7.62
N$71  (via drill 1)
  other vias: 33.02,5.08
N$72  (via drill 1)
  other vias: 33.02,2.54
N$73  (via drill 1)
  other vias: 27.94,15.24
N$74  (via drill 1)
  other vias: 25.4,15.24
N$75  (via drill 1)
  other vias: 22.86,15.24
N$76  (via drill 1)
  other vias: 20.32,15.24
N$77  (via drill 1)
  other vias: 17.78,15.24
N$78  (via drill 1)
  other vias: 15.24,15.24
N$79  (via drill 1)
  other vias: 2.54,12.7
N$80  (via drill 1)
  other vias: 2.54,10.16
N$81  (via drill 1)
  other vias: 2.54,7.62
N$82  (via drill 1)
  other vias: 15.24,17.78
N$83  (via drill 1)
  other vias: 17.78,17.78
N$84  (via drill 1)
  other vias: 20.32,17.78
N$85  (via drill 1)
  other vias: 22.86,17.78
N$86  (via drill 1)
  other vias: 25.4,17.78
N$87  (via drill 1)
  other vias: 27.94,17.78
N$88  (via drill 1)
  other vias: 27.94,20.32
N$89  (via drill 1)
  other vias: 25.4,20.32
N$90  (via drill 1)
  other vias: 22.86,20.32
N$91  (via drill 1)
  other vias: 20.32,20.32
N$92  (via drill 1)
  other vias: 17.78,20.32
N$93  (via drill 1)
  other vias: 15.24,20.32
PC0  (1 unrouted)
  Top 0.305: 59.05,50.16 66.04,43.18 JP2.3
  Bottom 0.305: SJ_DO0.1 29.21,46.35 34.29,51.44 49.53,51.44
PC1  (via drill 0.8)
  Top 0.305: JP2.4 64.77,36.83 64.77,43.18 59.05,48.9 v54.61,48.9
  Bottom 0.305: 46.99,48.9 v54.61,48.9 54.61,45.72 52.07,43.18 40.64,43.18 38.73,45.09 22.23,45.09 20.95,46.35 SJ_DO1.1
PC2  (via drill 0.8)
  Top 0.305: JP2.5 63.5,43.18 60.96,45.72 v52.07,45.72
  Bottom 0.305: v52.07,45.72 45.09,45.72
PC3  (via drill 0.8)
  Top 0.305: v49.53,44.45 60.96,44.45 62.23,43.18 62.23,37.47 63.5,36.2 JP2.6
  Bottom 0.305: v49.53,44.45 41.27,44.45
PC4
  Top 0.305: JP_SDA.2 58.42,33.66 59.69,34.92 59.69,36.83 JP2.7 60.96,37.47 62.23,36.2 62.23,34.92 63.5,33.66 SJ_DI0.2
PC5  (via drill 0.8)
  Top 0.305: JP_SCL.2 JP2.8 | SJ_DI1.2 v66.04,33.66
  Bottom 0.305: v66.04,33.66 62.87,33.66 JP2.8
RX33
  Bottom 0.305: JP_UART.2 39.37,36.83 39.37,16.83 38.42,15.88 35.56,15.88 34.92,16.51
SCL  (1 unrouted)
  Top 0.254: R_SCL.2 44.45,29.21 44.45,31.11 46.99,33.66 46.99,34.92 46.49,35.42 U2.2 46.49,39.55 42.23,43.81 34.29,43.81 31.75,46.35 31.75,53.98 30.84,54.88 U1.10
  Top 0.305: R_SCL.2 47.62,29.84 60.33,29.84 60.96,30.48 JP_SCL.1
  Top 0.406: 57.15,16.51 57.15,8.89 58.42,7.62 U3.6
  Bottom 0.305: 58.42,19.68 57.78,20.32 48.26,20.32 45.72,22.86 R_SCL.2
SDA  (1 unrouted)
  Top 0.254: R_SDA.2 47.62,32.38 47.62,35.56 46.99,36.2 U2.3 46.99,40.01 42.55,44.45 34.92,44.45 32.38,46.99 32.38,54.61 31.61,55.38 U1.9
  Top 0.305: R_SDA.2 53.34,30.48 54.16,31.3 JP_SDA.1
  Top 0.406: 54.61,16.51 54.61,8.89 55.88,7.62 U3.5
  Bottom 0.305: 49.53,17.78 44.45,22.86 44.45,29.21 R_SDA.2
TX33
  Bottom 0.305: 36.2,17.14 36.83,16.51 38.1,16.51 38.73,17.14 38.73,34.92 JP_UART.3
USB_D+
  Bottom 0.305: JP_USB.3 3.81,28.56 3.81,52.07 JP_SERV.5
USB_D-
  Bottom 0.305: JP_USB.2 3.17,26.66 3.17,53.98 JP_SERV.3
VCC
  Top 0.406: JP2.1 69.85,36.83 69.85,30.48 68.58,29.21 L1.1
  Top 0.508: R31.1 17.14,35.56 20.95,39.37 R12.1 | R21.1 27.3,35.56 28.57,36.83 R11.1
  Top 1.016: JP_UART.1 R_SDA.1 R_SCL.1 | JP2.1 68.58,43.81 48.9,63.5 15.24,63.5 12.7,60.96 12.7,57.15 11.43,55.88 10.16,55.88 JP_SERV.2
  Bottom 0.406: 33.66,15.88 34.29,15.24 38.73,15.24 40.64,17.14 R_SCL.1
  Bottom 1.016: JP_SERV.2 12.7,53.34 12.7,46.35 15.88,43.18 20.32,43.18 R12.1 21.59,43.18 27.94,43.18 R11.1 29.21,43.18 35.56,43.18 JP_UART.1

### Text on the board
tValues: PERIPHERALS-C
Document: D1- | D1+ | D0- | D0+ | A3 | A2 | A1 | A0 | GND | AGND | GND | +12V | GND | VCC | GND | TX | RX | VCC | RESET | GND | USER | GND | IWING-MRF Shield v0.1 / for MOTE v1.4 | D+ | CPE, KU | [iPAS 2013] | D- | VCC | AC- | AC+